# Altium schematic sheet Sheet1.SchDoc
size A4
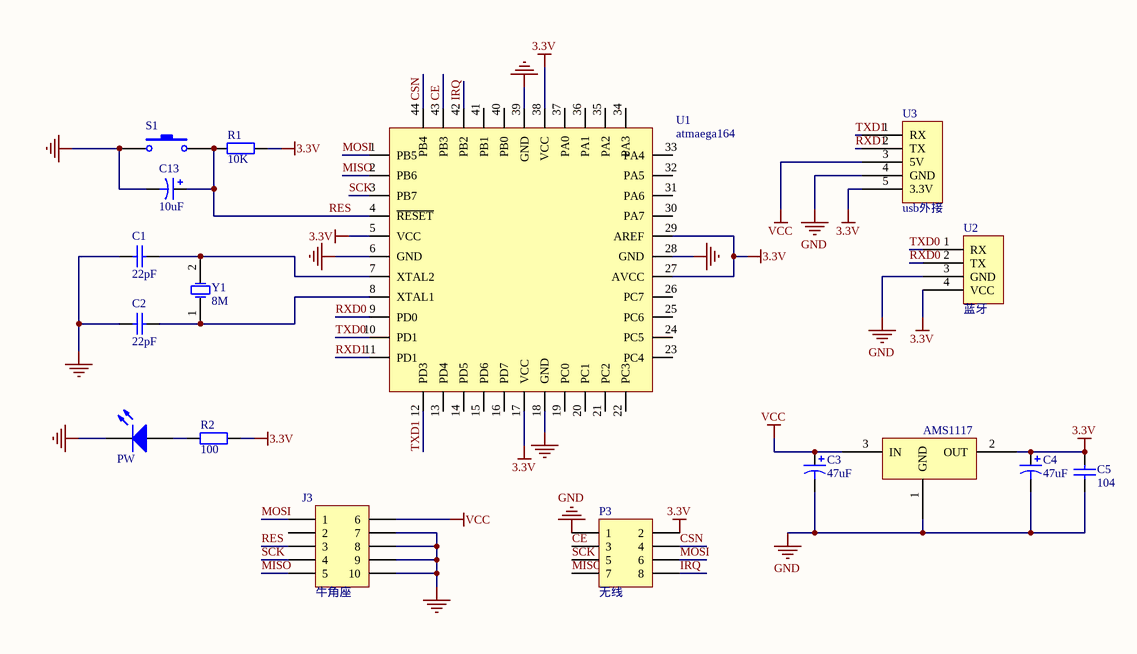
[diagram p0: Sheet1.SchDoc]

## Parts
1117_3.3V  AMS1117  [AMS1117-3.3V  SOT-223  贴片]
C1  value 22pF  [电容CBB224(0.22)]
C2  value 22pF  [电容CBB224(0.22)]
C3  value 47uF  [电容]
C4  value 47uF  [电容]
C5  value 104  [电容CBB224(0.22)]  (hidden comment: Cap)
C13  value 10uF  [电容]
J3  牛角座  [下载口（12345）]
P3  无线  [无线模块]
PW  (no value)  [LED]
R1  value 10K  [0805]
R2  value 100  [0805]
S1  (no value)  [4脚按键]
U1  atmaega164  [44贴片（顶层）]
U2  蓝牙  [蓝牙]
U3  usb外接  [usb]
Y1  8M  [晶振]

## Nets
3.3V: 1117_3.3V.2(OUT) C4.1 C5.1 P3.2 R1.1 R2.1 U1.5(VCC) U1.17(VCC) U1.27(AVCC) U1.29(AREF) U1.38(VCC) U2.4(VCC) U3.5(3.3V)
GND: 1117_3.3V.1(GND) C1.1 C2.1 C3.2 C4.2 C5.2 C13.2 J3.7 J3.8 J3.9 J3.10 P3.1 PW.2(K) S1.2 U1.6(GND) U1.18(GND) U1.28(GND) U1.39(GND) U2.3(GND) U3.4(GND)
VCC: 1117_3.3V.3(IN) C3.1 J3.6 U3.3(5V)
CE: P3.3 U1.43(PB3)
CSN: P3.4 U1.44(PB4)
IRQ: P3.8 U1.42(PB2)
MISO: J3.5 P3.7 U1.2(PB6)
MOSI: J3.1 P3.6 U1.1(PB5)
RES: C13.1 J3.3 R1.2 S1.1 U1.4(~{RESET})
RXD0: U1.9(PD0) U2.2(TX)
RXD1: U1.11(PD1) U3.2(TX)
SCK: J3.4 P3.5 U1.3(PB7)
TXD0: U1.10(PD1) U2.1(RX)
TXD1: U1.12(PD3) U3.1(RX)
NetC1_2: C1.2 U1.7(XTAL2) Y1.2(OSC2)
NetC2_2: C2.2 U1.8(XTAL1) Y1.1(OSC1)
NetPW_1: PW.1(A) R2.2

Not connected (* = marked no-connect by the designer): J3 2; U1 13(PD4) 14(PD5) 15(PD6) 16(PD7) 19(PC0) 20(PC1) 21(PC2) 22(PC3) 23(PC4) 24(PC5) 25(PC6) 26(PC7) 30(PA7) 31(PA6) 32(PA5) 33(PA4) 34(PA3) 35(PA2) 36(PA1) 37(PA0) 40(PB0) 41(PB1)

## Library data of the parts
1117_3.3V = Component_1
C1 C2 C5 = Cap: Capacitor; Published: 8-Jun-2000; LatestRevisionDate: 17-Jul-2002; LatestRevisionNote: Re-released for DXP Platform.; PackageReference: RAD-0.3; Publisher: Altium Limited
C3 C4 C13 = Cap Pol3: Polarized Capacitor (Surface Mount); Published: 8-Jun-2000; LatestRevisionDate: 29-May-2009; LatestRevisionNote: IPC-7351 Footprint Added.; PackageReference: C0805; Publisher: Altium Limited; PackageDescription: Chip Capacitor
J3 = Header 5X2A: Header, 5-Pin, Dual row; LatestRevisionDate: 17-Jul-2002; LatestRevisionNote: Re-released for DXP Platform.; Publisher: Altium Limited
P3 = Header 4X2: Header, 4-Pin, Dual row; LatestRevisionDate: 17-Jul-2002; LatestRevisionNote: Re-released for DXP Platform.; Publisher: Altium Limited
PW = LED0: Typical INFRARED GaAs LED; Published: 8-Jun-2000; LatestRevisionDate: 08-Jul-2005; LatestRevisionNote: Mech Layer 1 removed.; PackageReference: LED-0; Publisher: Altium Limited
R1 R2 = Res2: Resistor; Published: 8-Jun-2000; LatestRevisionDate: 17-Jul-2002; LatestRevisionNote: Re-released for DXP Platform.; PackageReference: AXIAL-0.4; Publisher: Altium Limited
S1 = SW-PB: Switch; Published: 24-Mar-1999; LatestRevisionDate: 17-Jul-2002; LatestRevisionNote: Re-released for DXP Platform.; PackageReference: SPST-2; Publisher: Altium Limited
Y1 = XTAL: Crystal Oscillator; Published: 8-Jun-2000; LatestRevisionDate: 17-Jul-2002; LatestRevisionNote: Re-released for DXP Platform.; PackageReference: R38; Publisher: Altium Limited